# Altium project pdb-24.PrjPcb
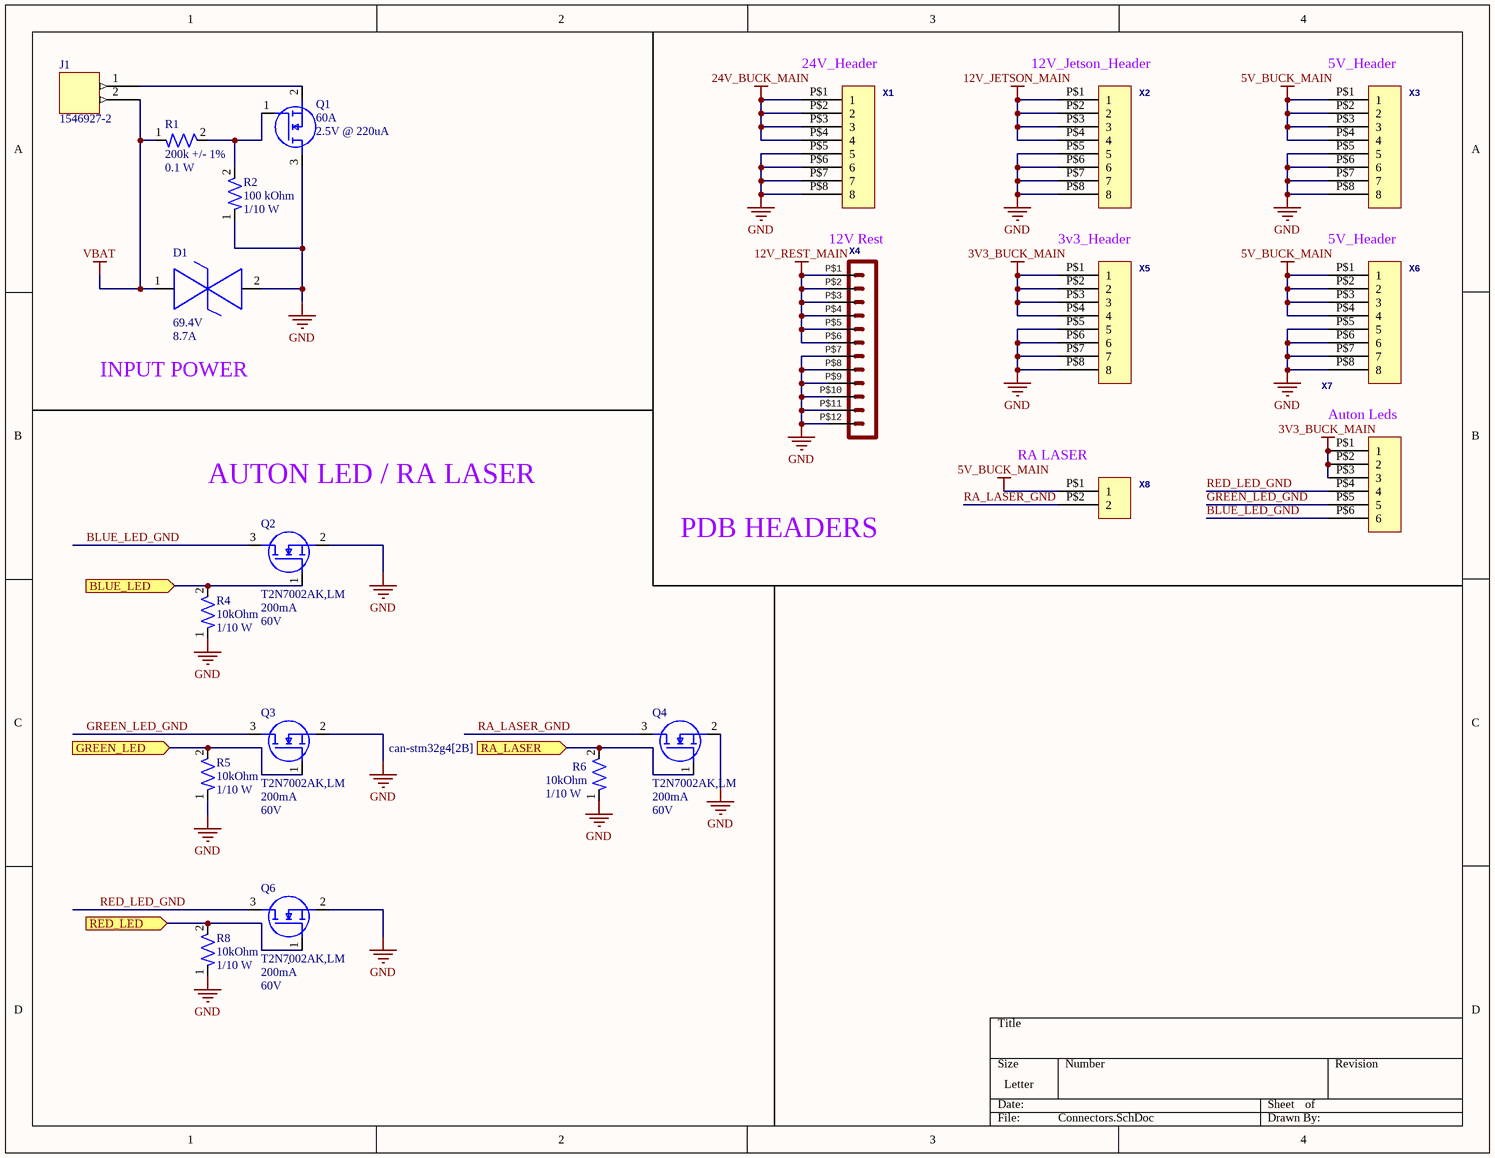
[diagram p0: Connectors.SchDoc]
4 sheets, 122 parts. Net scope: flat (ports and power ports of the same name join across sheets).
Board file: PDB_PCB.PcbDoc
Sheets:
  Connectors.SchDoc
  24V_Main.SchDoc
  12V_For_Bucks.SchDoc
  5V-and-3V3-ldo.SchDoc

## Sheet Connectors.SchDoc
size Letter; SheetNumber: 1; SheetTotal: 9

### Parts
D1  Vclamp: 69.4V  Peak pulser current: 8.7A  [DO-214AA (SMBJ)]  (hidden comment: SMBJE43CAH)
J1  1546927-2  [CONN-1546927-2]
Q1  Drain Current: 60A  Vgs: 2.5V @ 220uA  [NMOS-8PowerVDFN]  (hidden comment: TPH7R006PL,L1Q)
Q2  T2N7002AK,LM  Id-Continuous: 200mA  VDS-Max: 60V  [NMOS-SOT23-3]
Q3  T2N7002AK,LM  Id-Continuous: 200mA  VDS-Max: 60V  [NMOS-SOT23-3]
Q4  T2N7002AK,LM  Id-Continuous: 200mA  VDS-Max: 60V  [NMOS-SOT23-3]
Q6  T2N7002AK,LM  Id-Continuous: 200mA  VDS-Max: 60V  [NMOS-SOT23-3]
R1  Resistance: 200k +/- 1%  Power Rating: 0.1 W  [RES-0603]  (hidden comment: ERJ-3EKF2003V)
R2  Resistance: 100 kOhm  Power: 1/10 W  [RES-0603]  (hidden comment: RC0603FR-07100KL)
R4  Resistance: 10kOhm  Power: 1/10 W  [RES-0603]  (hidden comment: RMCF0603ZT0R00)
R5  Resistance: 10kOhm  Power: 1/10 W  [RES-0603]  (hidden comment: RMCF0603ZT0R00)
R6  Resistance: 10kOhm  Power: 1/10 W  [RES-0603]  (hidden comment: RMCF0603ZT0R00)
R8  Resistance: 10kOhm  Power: 1/10 W  [RES-0603]  (hidden comment: RMCF0603ZT0R00)
X1  Molex 43045-0812  [43045-0812]  (value not drawn)
X2  Molex 43045-0812  [43045-0812]  (value not drawn)
X3  Molex 43045-0812  [43045-0812]  (value not drawn)
X4  Molex - Micro-Fit 3.0 Series connector,  3.00mm (0.118") pitch header, 12 positions.  [43045-1212]  (value not drawn)
X5  Molex 43045-0812  [43045-0812]  (value not drawn)
X6  Molex 43045-0812  [43045-0812]  (value not drawn)
X7  Molex 43045-0612  [43045-0612]  (value not drawn)
X8  Molex 43650-0215  [43650-0215]  (value not drawn)

### Ports
BLUE_LED (in, see can-stm32g4[2C]), GREEN_LED (in, see can-stm32g4[2C]), RA_LASER (in, see can-stm32g4[2B]), RED_LED (in, see can-stm32g4[2C])

### Nets
3V3_BUCK_MAIN: X5.P$1(1) X5.P$2(2) X5.P$3(3) X5.P$4(4) X7.P$1(1) X7.P$2(2) X7.P$3(3)
5V_BUCK_MAIN: X3.P$1(1) X3.P$2(2) X3.P$3(3) X3.P$4(4) X6.P$1(1) X6.P$2(2) X6.P$3(3) X6.P$4(4) X8.P$1(1)
12V_JETSON_MAIN: X2.P$1(1) X2.P$2(2) X2.P$3(3) X2.P$4(4)
12V_REST_MAIN: X4.P$1 X4.P$2 X4.P$3 X4.P$4 X4.P$5 X4.P$6
24V_BUCK_MAIN: X1.P$1(1) X1.P$2(2) X1.P$3(3) X1.P$4(4)
GND: D1.2 Q1.3(D) Q2.2(S) Q3.2(S) Q4.2(S) Q6.2(S) R2.1 R4.1 R5.1 R6.1 R8.1 X1.P$5(5) X1.P$6(6) X1.P$7(7) X1.P$8(8) X2.P$5(5) X2.P$6(6) X2.P$7(7) X2.P$8(8) X3.P$5(5) X3.P$6(6) X3.P$7(7) X3.P$8(8) X4.P$7 X4.P$8 X4.P$9 X4.P$10 X4.P$11 X4.P$12 X5.P$5(5) X5.P$6(6) X5.P$7(7) X5.P$8(8) X6.P$5(5) X6.P$6(6) X6.P$7(7) X6.P$8(8)
VBAT: D1.1 J1.2 R1.1
BLUE_LED_GND: Q2.3(D) X7.P$6(6)
GREEN_LED_GND: Q3.3(D) X7.P$5(5)
RA_LASER_GND: Q4.3(D) X8.P$2(2)
RED_LED_GND: Q6.3(D) X7.P$4(4)
NetJ1_1: J1.1 Q1.2(S)
NetQ1_1: Q1.1(G) R1.2 R2.2
NetQ2_1: Q2.1(G) R4.2 ; port BLUE_LED
NetQ3_1: Q3.1(G) R5.2 ; port GREEN_LED
NetQ4_1: Q4.1(G) R6.2 ; port RA_LASER
NetQ6_1: Q6.1(G) R8.2 ; port RED_LED

### Notes on the sheet
- (near X1) 24V_Header
- (near X2) 12V_Jetson_Header
- (near X3) 5V_Header
- 12V Rest
- 3v3_Header
- 5V_Header
- INPUT POWER
- Auton Leds
- AUTON LED / RA LASER
- (near X8) RA LASER
- PDB HEADERS

### Library data of the parts
D1 = DIO-69.4V-0001: 69.4V Clamp 8.7A Ipp Tvs Diode Surface Mount DO-214AA (SMBJ); Channels: Bidirectional; Breakdown VOltage: 47.8V; Reverse working maximum voltage: 43V; Package: DO-214AA (SMBJ)
J1 = CON-2POS-0003
Q1 = NMOS-60A-0001: N-Channel 60 V 60A (Tc) 81W (Tc) Surface Mount 8-SOP Advance (5x5); Vdss: 60V; Vgs(Max): 20V; Package: 8-PowerVDFN
Q2-Q4 Q6 = NMOS-200MA-0001: MOSFET N-CH 60V 200MA SOT23; Manufacturer: Toshiba; FET type: N-Channel; Rds On-Max: 3.9Ohm; Vgs-Max: 20V; Assembled?: no; Manufacturer Part Number: T2N7002AK,LM; Package: SOT-23-3
R1 = RES-200K-0001: 200 kOhms ±1% 0.1W, 1/10W Chip Resistor 0603 (1608 Metric) Automotive AEC-Q200 Thick Film; Manufacturer: Panasonic Electronic Components; Assembled?: Yes; MFP: ERJ-3EKF2003V; Package SIze: 0603
R2 = RES-100K-0003: 100 kOhms ±1% 0.1W, 1/10W Chip Resistor 0603 (1608 Metric) Moisture Resistant Thick Film; Tolerance: +/- 1%; Assembled?: No; Package Size: 0603
R4-R6 R8 = RES-0-0001: 0 Ohms Jumper 0.1W, 1/10W Chip Resistor 0603 (1608 Metric) Automotive AEC-Q200 Thick Film; Package Size: 0603
X1-X3 X5 X6 = Micro-Fit Molex 8 Pin 2 Row Vertical: GateName_1: G$1; SymbolName_1: HEADER_POS8; DeviceSetName: HEADER_POS8_?; DeviceName: 43045-0812; LibraryName: con-molex-micro-fit-3_0_2; Package: 43045-0812
X4 = HEADER_POS12_?43045-1212: GateName_1: G$1; SymbolName_1: HEADER_POS12; DeviceName: 43045-1212; LibraryName: con-molex-micro-fit-3_0_2; DeviceSetName: HEADER_POS12_?; Package: 43045-1212
X7 = Micro-Fit Molex 6 Pin 2 Row Vertical: GateName_1: G$1; SymbolName_1: HEADER_POS6; DeviceSetName: HEADER_POS6_?; DeviceName: 43045-0612; LibraryName: con-molex-micro-fit-3_0_2; Package: 43045-0612
X8 = Micro-Fit Molex 2 Pin Vertical: GateName_1: G$1; SymbolName_1: HEADER_POS2; DeviceSetName: HEADER_POS2_?; DeviceName: 43650-0215; LibraryName: con-molex-micro-fit-3_0_2; Package: 43650-0215

## Sheet 24V_Main.SchDoc
size A; SheetNumber: 2; SheetTotal: 9
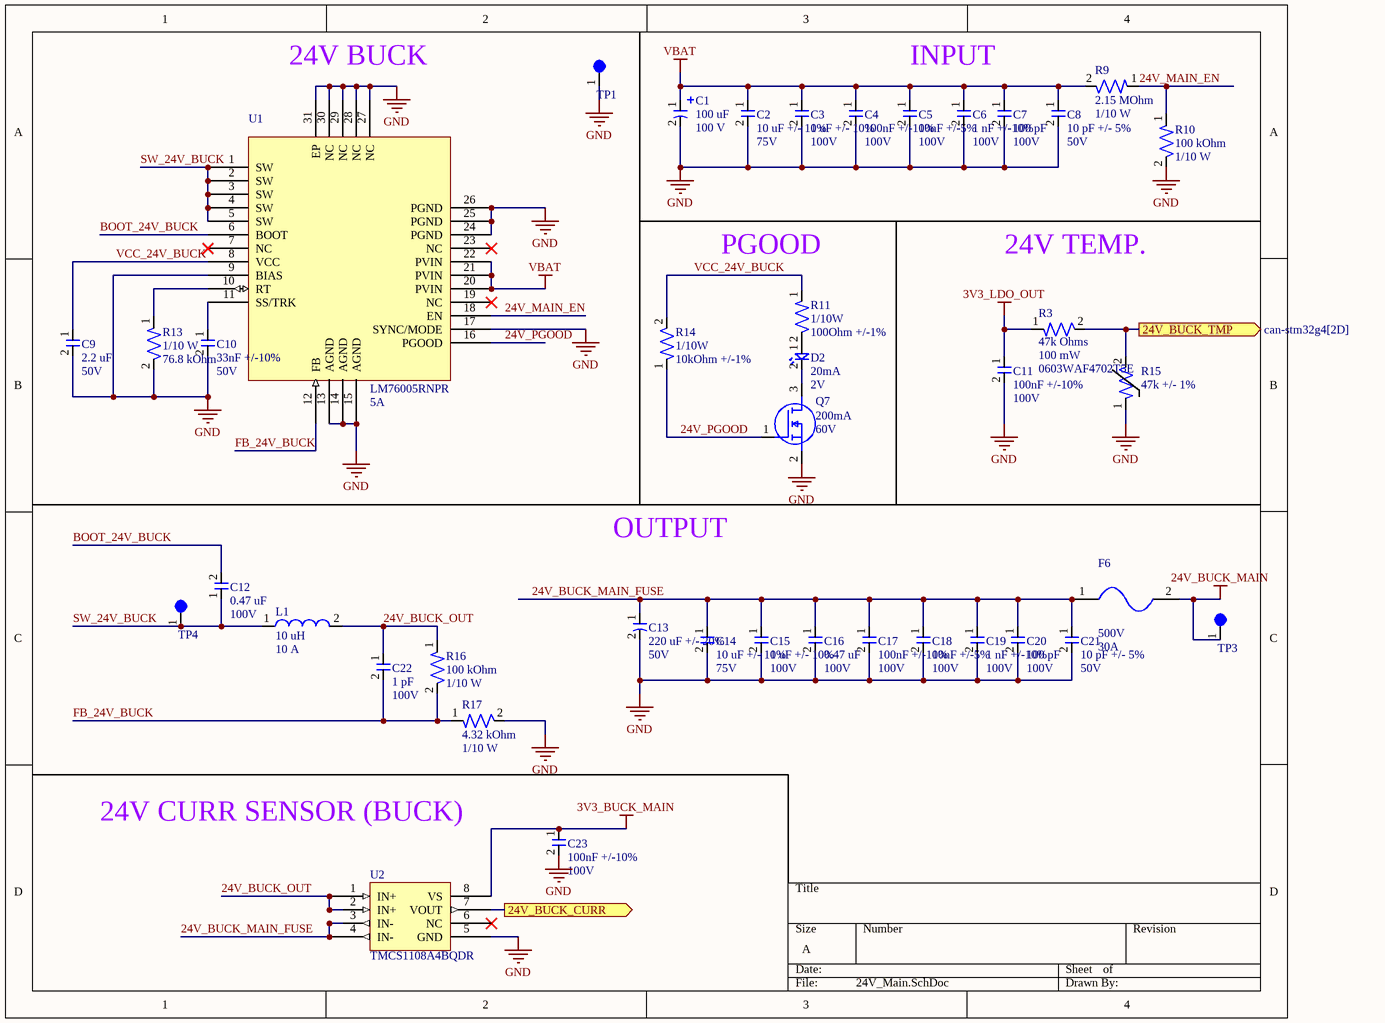
[diagram p1: 24V_Main.SchDoc]

### Parts
C1  Capacitance: 100 uF  Voltage: 100 V  [ELEC-100U-0001]  (hidden comment: 100SEV100M12.5X16)
C2  Capacitance: 10 uF +/- 10%  Voltage Rating: 75V  [CAP-1210]  (hidden comment: C3225X7R1N106K250AC)
C3  Capacitance: 1 uF +/- 10%  Voltage: 100V  [CAP-1206 - duplicate]  (hidden comment: CL31B105KCHNNNE)
C4  Capacitance: 100nF +/-10%  Voltage Rating: 100V  [CAP-0603]  (hidden comment: CC0603KRX7R0BB104)
C5  Capacitance: 10nF +/-5%  Voltage Rating: 100V  [CAP-0603]  (hidden comment: C1608C0G2A103J080AC)
C6  Capacitance: 1 nF +/-10%  Voltage: 100V  [CAP-0603]  (hidden comment: C0603Y102K1RAC7867)
C7  Capacitance: 100 pF  Voltage: 100V  [CAP-0603]  (hidden comment: 0603N101J101CT)
C8  Capacitance: 10 pF +/- 5%  Voltage Rating: 50V  [CAP-0603]  (hidden comment: 0603N100J500CT)
C9  Capacitance: 2.2 uF  oltage: 50V  [CAP-0603]  (hidden comment: UMK107BBJ225KA-T)
C10  Capacitance: 33nF +/-10%  Voltage Rating: 50V  [CAP-0603]  (hidden comment: CC0603KRX7R9BB333)
C11  Capacitance: 100nF +/-10%  Voltage Rating: 100V  [CAP-0603]  (hidden comment: CC0603KRX7R0BB104)
C12  Capacitance: 0.47 uF  Voltage: 100V  [CAP-0805]  (hidden comment: KAM21KR72A474KL)
C13  Capacitance: 220 uF +/- 20%  Voltage Rating: 50V  [ELEC-220U-0003]  (hidden comment: 50TZV220M10X10.5)
C14  Capacitance: 10 uF +/- 10%  Voltage Rating: 75V  [CAP-1210]  (hidden comment: C3225X7R1N106K250AC)
C15  Capacitance: 1 uF +/- 10%  Voltage: 100V  [CAP-1206 - duplicate]  (hidden comment: CL31B105KCHNNNE)
C16  Capacitance: 0.47 uF  Voltage: 100V  [CAP-0805]  (hidden comment: KAM21KR72A474KL)
C17  Capacitance: 100nF +/-10%  Voltage Rating: 100V  [CAP-0603]  (hidden comment: CC0603KRX7R0BB104)
C18  Capacitance: 10nF +/-5%  Voltage Rating: 100V  [CAP-0603]  (hidden comment: C1608C0G2A103J080AC)
C19  Capacitance: 1 nF +/-10%  Voltage: 100V  [CAP-0603]  (hidden comment: C0603Y102K1RAC7867)
C20  Capacitance: 100 pF  Voltage: 100V  [CAP-0603]  (hidden comment: 0603N101J101CT)
C21  Capacitance: 10 pF +/- 5%  Voltage Rating: 50V  [CAP-0603]  (hidden comment: 0603N100J500CT)
C22  Capacitance: 1 pF  Voltage: 100V  [CAP-0603]  (hidden comment: 885012006087)
C23  Capacitance: 100nF +/-10%  Voltage Rating: 100V  [CAP-0603]  (hidden comment: CC0603KRX7R0BB104)
D2  Current Rating: 20mA  Vf: 2V  [LED-0603]  (hidden comment: 150060AS75000)
F6  Voltage Rating: 500V  Current: 30A  [FUSE-ATM-0001]  (hidden comment: 3568)
L1  Inductance: 10 uH  DCI: 10 A  [PWRIND-10U-0002]  (hidden comment: SRP1270-100M)
Q7  Id-Continuous: 200mA  VDS-Max: 60V  [NMOS-SOT23-3]  (hidden comment: T2N7002AK,LM)
R3  0603WAF4702T5E  [RES-0603]
R9  Resistance: 2.15 MOhm  Power: 1/10 W  [RES-0603]  (hidden comment: RC0603FR-072M15L)
R10  Resistance: 100 kOhm  Power: 1/10 W  [RES-0603]  (hidden comment: RC0603FR-07100KL)
R11  Power Rating: 1/10W  Resistance: 100Ohm +/-1%  [RES-0603]  (hidden comment: AC0603FR-10100RL)
R13  Power: 1/10 W  Resistance: 76.8 kOhm  [RES-0603]  (hidden comment: RC0603FR-0776K8L)
R14  Power Rating: 1/10W  Resistance: 10kOhm +/-1%  [RES-0603]  (hidden comment: RC0603FR-0710KP)
R15  Resistance: 47k +/- 1%  [RES-0402]  (hidden comment: TMP6431DECR)
R16  Resistance: 100 kOhm  Power: 1/10 W  [RES-0603]  (hidden comment: RC0603FR-07100KL)
R17  Resistance: 4.32 kOhm  Power: 1/10 W  [RES-0603]  (hidden comment: RC0603FR-074K32L)
TP1  5003  [TEST-POINT-0001]  (value not drawn)
TP3  5003  [TEST-POINT-0001]  (value not drawn)
TP4  5003  [TEST-POINT-0001]  (value not drawn)
U1  LM76005RNPR  Current: 5A  [IC-30-WQFN(6x4)]
U2  TMCS1108A4BQDR  [IC-CURRENT-0001]

### Ports
24V_BUCK_CURR (out, see can-stm32g4[2D]), 24V_BUCK_TMP (out, see can-stm32g4[2D])

### Nets
3V3_BUCK_MAIN: C23.1 U2.8(VS)
3V3_LDO_OUT: C11.1 R3.1
24V_BUCK_MAIN: F6.2 TP3.1
GND: C1.2 C2.2 C3.2 C4.2 C5.2 C6.2 C7.2 C8.2 C9.2 C10.2 C11.2 C13.2 C14.2 C15.2 C16.2 C17.2 C18.2 C19.2 C20.2 C21.2 C23.2 Q7.2(S) R10.2 R13.2 R15.1 R17.2 TP1.1 U1.9(BIAS) U1.13(AGND) U1.14(AGND) U1.15(AGND) U1.17(SYNC/MODE) U1.24(PGND) U1.25(PGND) U1.26(PGND) U1.27(NC) U1.28(NC) U1.29(NC) U1.30(NC) U1.31(EP) U2.5(GND)
VBAT: C1.1 C2.1 C3.1 C4.1 C5.1 C6.1 C7.1 C8.1 R9.2 U1.20(PVIN) U1.21(PVIN) U1.22(PVIN)
24V_BUCK_MAIN_FUSE: C13.1 C14.1 C15.1 C16.1 C17.1 C18.1 C19.1 C20.1 C21.1 F6.1 U2.3(IN-) U2.4(IN-)
24V_BUCK_OUT: C22.1 L1.2 R16.1 U2.1(IN+) U2.2(IN+)
24V_MAIN_EN: R9.1 R10.1 U1.18(EN)
24V_PGOOD: Q7.1(G) R14.1 U1.16(PGOOD)
BOOT_24V_BUCK: C12.2 U1.6(BOOT)
FB_24V_BUCK: C22.2 R16.2 R17.1 U1.12(FB)
SW_24V_BUCK: C12.1 L1.1 TP4.1 U1.1(SW) U1.2(SW) U1.3(SW) U1.4(SW) U1.5(SW)
VCC_24V_BUCK: C9.1 R11.1 R14.2 U1.8(VCC)
NetC10_1: C10.1 U1.11(SS/TRK)
NetD2_1: D2.1 R11.2
NetD2_2: D2.2 Q7.3(D)
NetR3_2: R3.2 R15.2 ; port 24V_BUCK_TMP
NetR13_1: R13.1 U1.10(RT)
NetU2_7: U2.7(VOUT) ; port 24V_BUCK_CURR

Not connected (* = marked no-connect by the designer): U1 7(NC)* 19(NC)* 23(NC)*; U2 6(NC)*

### Notes on the sheet
- 24V BUCK
- INPUT
- (near R11) PGOOD
- 24V TEMP.
- OUTPUT
- 24V CURR SENSOR (BUCK)
- (in symbol RES-47k-0001-JLC) 47k Ohms; 100 mW

### Library data of the parts
C1 = ELEC-100U-0001: 100 µF 100 V Aluminum Electrolytic Capacitors Radial, Can - SMD 2000 Hrs @ 85°C; Manufacturer: Rubycon; Tolerance: +/- 20%; Assembled?: No; ESR: idk check the datasheet i couldnt find it
C2 C14 = CAP-10U-0004: 10 µF ±10% 75V Ceramic Capacitor X7R 1210 (3225 Metric)
C3 C15 = CAP-1U-0001: 1 µF ±10% 100V Ceramic Capacitor X7R 1206 (3216 Metric)
C4 C11 C17 C23 = CAP-100N-0001: CAP CER 0.1UF 100V X7R 0603; Manufacturer: YAGEO; Assembled?: no; Manufacturer Part Number: CC0603KRX7R0BB104; Temperature Coefficient: X7R; Package Size: 0603
C5 C18 = CAP-10N-0002: CAP CER 10000PF 100V C0G 0603; Manufacturer: TDK Corporation; Temperature Coefficient: C0G/NP0; Assembled?: no; Manufacturer Part Number: C1608C0G2A103J080AC; Package Size: 0603
C6 C19 = CAP-1N-0001: 1000 pF ±10% 100V Ceramic Capacitor X7R 0603 (1608 Metric)
C7 C20 = CAP-100P-0002: 100 pF ±5% 100V Ceramic Capacitor C0G, NP0 0603 (1608 Metric); Tolerance: +/-5%; Temp Coeff: C0G/NP0; Package Size: 0603
C8 C21 = CAP-10P-0001: 10 pF ±5% 50V Ceramic Capacitor C0G, NP0 0603 (1608 Metric); Manufacturer: Walshin Technology Corporation; Assembled?: Yes; Manufacturer Part Number: 0603N100J500CT; Temperature Coefficient: C0G, NP0; Package Size: 0603
C9 = CAP-2.2U-0001: 2.2 µF ±10% 50V Ceramic Capacitor X5R 0603 (1608 Metric)
C10 = CAP-33N-0001: 0.033 µF ±10% 50V Ceramic Capacitor X7R 0603 (1608 Metric); Manufacturer: YAGEO; Assembled?: no; Manufacturer Part Number: CC0603KRX7R9BB333; Temperature Coefficient: X7R; Package Size: 0603
C12 C16 = CAP-0.47U-0001: 0.47 µF ±10% 100V Ceramic Capacitor X7R 0805 (2012 Metric); Tolerance: +/- 10%; Assembled?: No; Temperature Coefficient: X7R; Package Size: 0805
C13 = ELEC-220U-0003: 220 µF 50 V Aluminum Electrolytic Capacitors Radial, Can - SMD 2000 Hrs @ 105°C; Size: .406inx.406in*.413in
C22 = CAP-1P-0001: 1 pF ±0.25pF 100V Ceramic Capacitor C0G, NP0 0603 (1608 Metric); Tolerance: +/- 0.25 pF; Temperature Coefficient: C0G/NP0; Assembled?: No; Package Size: 0603
D2 = LED_Amber_0001: CAP CER 0.1UF 100V X7R 0603; Manufacturer: Wurth Electronik; Assembled?: no; Color: Amber; Manufacturer Part Number: 150060AS75000; Package Size: 0603
F6 = FUSE-ATM-0001: Fuse Holder 30 A 500V 1 Circuit Blade Through Hole; Manufacturer Part Number: 3568
L1 = PWRIND-10U-0002: 10 µH Shielded Drum Core, Wirewound Inductor 10 A 16.8mOhm Max Nonstandard; Tolerance: +/- 20%; Isat: 16A; Assembled?: No; DCR: 16.8 mOhm
Q7 = NMOS-200MA-0001: as Q2 on sheet Connectors; Manufacturer Part Number: T2N7002AK,LM; Package: SOT-23-3
R3 = RES-47k-0001-JLC: 100mW Thick Film Resistors 75V ±100ppm/℃ ±1% 47kΩ 0603 Chip Resistor - Surface Mount ROHS; Resistance: 47kOhms; Power: 100mW
R9 = RES-2.15M-0001: 2.15 MOhms ±1% 0.1W, 1/10W Chip Resistor 0603 (1608 Metric) Moisture Resistant Thick Film; Tolerance: +/-1%; Assembled?: No; Package Size: 0603
R10 R16 = RES-100K-0003: as R2 on sheet Connectors; Package Size: 0603
R11 = RES-100-0002: 100 Ohms ±1% 0.1W, 1/10W Chip Resistor 0603 (1608 Metric) Automotive AEC-Q200 Thick Film; Manufacturer: YAGEO; Assembled?: no; Manufacturer Part Number: AC0603FR-10100RL; Package Size: 0603
R13 = RES-76.8K-0001: 76.8 kOhms ±1% 0.1W, 1/10W Chip Resistor 0603 (1608 Metric) Moisture Resistant Thick Film; Manufacturer: Yageo; Tolerance: +/- 1%; Package Size: 0603
R14 = RES-10K-0002: RES SMD 10K OHM 1% 1/10W 0603; Manufacturer: YAGEO; Assembled?: no; Manufacturer Part Number: RC0603FR-0710KP; Package Size: 0603
R15 = THERM-47K-0001: PTC Thermistor 47 kOhms 0402 (1006 Metric); Manufacturer: Texas Instruments; Manufacturer Part Number: TMP6431DECR; Package Size: 0402
R17 = RES-4.32K-0001: 4.32 kOhms ±1% 0.1W, 1/10W Chip Resistor 0603 (1608 Metric) Moisture Resistant Thick Film; Tolerance: +/-1%; Assembled?: No; Package Size: 0603
TP1 TP3 TP4 = TEST-POINT-0001: Oranange PC Test Point, Miniature Phoisphor Bronze Silver Plating Through Hole Mounting Type
U1 = IC-BUCK-0006: Buck Switching Regulator IC Positive Adjustable 1V 1 Output 5A 30-WFQFN Exposed Pad; Manufacturer: Texas Instruments; Assembled?: no; Manufacturer Part Number: LM76005RNPR; Type: Buck; Package: 30-WFQFN
U2 = IC-CURRENT-0004: Current Sensor 1 Channel Hall Effect Bidirectional 8-SOIC (0.154", 3.90mm Width); Assembled?: No; Supply Voltage: 5V; Footprint: 8-SOIC

## Sheet 12V_For_Bucks.SchDoc
size A; SheetNumber: 4; SheetTotal: 9
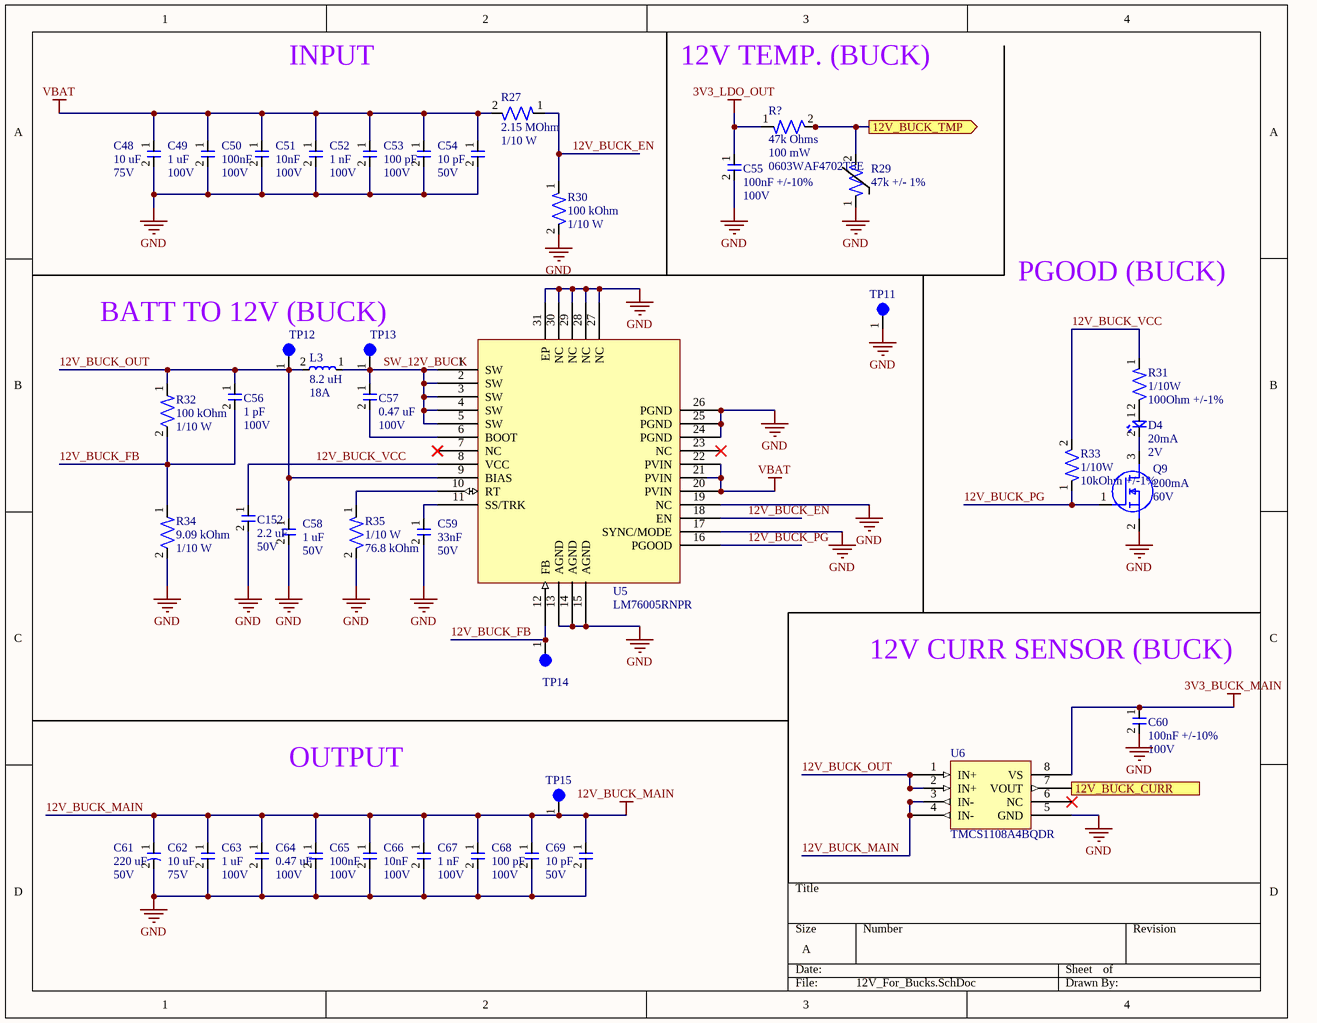
[diagram p2: 12V_For_Bucks.SchDoc]

### Parts
C48  Capacitance: 10 uF  Voltage Rating: 75V  [CAP-1210]  (hidden comment: C3225X7R1N106K250AC)
C49  Capacitance: 1 uF  Voltage: 100V  [CAP-1206 - duplicate]  (hidden comment: CL31B105KCHNNNE)
C50  Capacitance: 100nF  Voltage Rating: 100V  [CAP-0603]  (hidden comment: CC0603KRX7R0BB104)
C51  Capacitance: 10nF  Voltage Rating: 100V  [CAP-0603]  (hidden comment: C1608C0G2A103J080AC)
C52  Capacitance: 1 nF  Voltage: 100V  [CAP-0603]  (hidden comment: C0603Y102K1RAC7867)
C53  Capacitance: 100 pF  Voltage: 100V  [CAP-0603]  (hidden comment: 0603N101J101CT)
C54  Capacitance: 10 pF  Voltage Rating: 50V  [CAP-0603]  (hidden comment: 0603N100J500CT)
C55  Capacitance: 100nF +/-10%  Voltage Rating: 100V  [CAP-0603]  (hidden comment: CC0603KRX7R0BB104)
C56  Capacitance: 1 pF  Voltage: 100V  [CAP-0603]  (hidden comment: 885012006087)
C57  Capacitance: 0.47 uF  Voltage: 100V  [CAP-0805]  (hidden comment: KAM21KR72A474KL)
C58  Capacitance: 1 uF  Voltage: 50V  [CAP-0603]  (hidden comment: UMK107AB7105KA-T)
C59  Capacitance: 33nF  Voltage Rating: 50V  [CAP-0603]  (hidden comment: CC0603KRX7R9BB333)
C60  Capacitance: 100nF +/-10%  Voltage Rating: 100V  [CAP-0603]  (hidden comment: CC0603KRX7R0BB104)
C61  Capacitance: 220 uF  Voltage Rating: 50V  [ELEC-220U-0003]  (hidden comment: 50TZV220M10X10.5)
C62  Capacitance: 10 uF  Voltage Rating: 75V  [CAP-1210]  (hidden comment: C3225X7R1N106K250AC)
C63  Capacitance: 1 uF  Voltage: 100V  [CAP-1206 - duplicate]  (hidden comment: CL31B105KCHNNNE)
C64  Capacitance: 0.47 uF  Voltage: 100V  [CAP-0805]  (hidden comment: KAM21KR72A474KL)
C65  Capacitance: 100nF  Voltage Rating: 100V  [CAP-0603]  (hidden comment: CC0603KRX7R0BB104)
C66  Capacitance: 10nF  Voltage Rating: 100V  [CAP-0603]  (hidden comment: C1608C0G2A103J080AC)
C67  Capacitance: 1 nF  Voltage: 100V  [CAP-0603]  (hidden comment: C0603Y102K1RAC7867)
C68  Capacitance: 100 pF  Voltage: 100V  [CAP-0603]  (hidden comment: 0603N101J101CT)
C69  Capacitance: 10 pF  Voltage Rating: 50V  [CAP-0603]  (hidden comment: 0603N100J500CT)
C152  Capacitance: 2.2 uF  oltage: 50V  [CAP-0603]  (hidden comment: UMK107BBJ225KA-T)
D4  Current Rating: 20mA  Vf: 2V  [LED-0603]  (hidden comment: 150060AS75000)
L3  Inductance: 8.2 uH  DCI: 18A  [PWRIND-8.2U-0002]  (hidden comment: IHLP6767GZER8R2M01)
Q9  Id-Continuous: 200mA  VDS-Max: 60V  [NMOS-SOT23-3]  (hidden comment: T2N7002AK,LM)
R27  Resistance: 2.15 MOhm  Power: 1/10 W  [RES-0603]  (hidden comment: RC0603FR-072M15L)
R29  Resistance: 47k +/- 1%  [RES-0402]  (hidden comment: TMP6431DECR)
R30  Resistance: 100 kOhm  Power: 1/10 W  [RES-0603]  (hidden comment: RC0603FR-07100KL)
R31  Power Rating: 1/10W  Resistance: 100Ohm +/-1%  [RES-0603]  (hidden comment: AC0603FR-10100RL)
R32  Resistance: 100 kOhm  Power: 1/10 W  [RES-0603]  (hidden comment: RC0603FR-07100KL)
R33  Power Rating: 1/10W  Resistance: 10kOhm +/-1%  [RES-0603]  (hidden comment: RC0603FR-0710KP)
R34  Resistance: 9.09 kOhm  Power: 1/10 W  [RES-0603]  (hidden comment: RC0603FR-079K09L)
R35  Power: 1/10 W  Resistance: 76.8 kOhm  [RES-0603]  (hidden comment: RC0603FR-0776K8L)
R?  0603WAF4702T5E  [RES-0603]
TP11  5003  [TEST-POINT-0001]  (value not drawn)
TP12  5003  [TEST-POINT-0001]  (value not drawn)
TP13  5003  [TEST-POINT-0001]  (value not drawn)
TP14  5003  [TEST-POINT-0001]  (value not drawn)
TP15  5003  [TEST-POINT-0001]  (value not drawn)
U5  LM76005RNPR  [IC-30-WQFN(6x4)]
U6  TMCS1108A4BQDR  [IC-CURRENT-0001]

### Ports
12V_BUCK_CURR (out, see can-stm32g4[1D]), 12V_BUCK_TMP (out, see can-stm32g4[1D])

### Nets
3V3_BUCK_MAIN: C60.1 U6.8(VS)
3V3_LDO_OUT: C55.1 R?.1
12V_BUCK_MAIN: C61.1 C62.1 C63.1 C64.1 C65.1 C66.1 C67.1 C68.1 C69.1 TP15.1 U6.3(IN-) U6.4(IN-)
GND: C48.2 C49.2 C50.2 C51.2 C52.2 C53.2 C54.2 C55.2 C58.2 C59.2 C60.2 C61.2 C62.2 C63.2 C64.2 C65.2 C66.2 C67.2 C68.2 C69.2 C152.2 Q9.2(S) R29.1 R30.2 R34.2 R35.2 TP11.1 U5.13(AGND) U5.14(AGND) U5.15(AGND) U5.17(SYNC/MODE) U5.19(NC) U5.24(PGND) U5.25(PGND) U5.26(PGND) U5.27(NC) U5.28(NC) U5.29(NC) U5.30(NC) U5.31(EP) U6.5(GND)
VBAT: C48.1 C49.1 C50.1 C51.1 C52.1 C53.1 C54.1 R27.2 U5.20(PVIN) U5.21(PVIN) U5.22(PVIN)
12V_BUCK_EN: R27.1 R30.1 U5.18(EN)
12V_BUCK_FB: C56.2 R32.2 R34.1 TP14.1 U5.12(FB)
12V_BUCK_OUT: C56.1 C58.1 L3.2 R32.1 TP12.1 U5.9(BIAS) U6.1(IN+) U6.2(IN+)
12V_BUCK_PG: Q9.1(G) R33.1 U5.16(PGOOD)
12V_BUCK_VCC: C152.1 R31.1 R33.2 U5.8(VCC)
SW_12V_BUCK: C57.1 L3.1 TP13.1 U5.1(SW) U5.2(SW) U5.3(SW) U5.4(SW) U5.5(SW)
NetC57_2: C57.2 U5.6(BOOT)
NetC59_1: C59.1 U5.11(SS/TRK)
NetD4_1: D4.1 R31.2
NetD4_2: D4.2 Q9.3(D)
NetR29_2: R29.2 R?.2 ; port 12V_BUCK_TMP
NetR35_1: R35.1 U5.10(RT)
NetU6_7: U6.7(VOUT) ; port 12V_BUCK_CURR

Not connected (* = marked no-connect by the designer): U5 7(NC)* 23(NC)*; U6 6(NC)*

### Notes on the sheet
- INPUT
- 12V TEMP. (BUCK)
- PGOOD (BUCK)
- BATT TO 12V (BUCK)
- (near C60) 12V CURR SENSOR (BUCK)
- OUTPUT
- (in symbol RES-47k-0001-JLC) 47k Ohms; 100 mW

### Library data of the parts
C48 C62 = CAP-10U-0004: as C2 on sheet 24V_Main
C49 C63 = CAP-1U-0001: as C3 on sheet 24V_Main
C50 C55 C60 C65 = CAP-100N-0001: as C4 on sheet 24V_Main; Manufacturer Part Number: CC0603KRX7R0BB104; Temperature Coefficient: X7R; Package Size: 0603
C51 C66 = CAP-10N-0002: as C5 on sheet 24V_Main; Manufacturer Part Number: C1608C0G2A103J080AC; Package Size: 0603
C52 C67 = CAP-1N-0001: as C6 on sheet 24V_Main
C53 C68 = CAP-100P-0002: as C7 on sheet 24V_Main; Package Size: 0603
C54 C69 = CAP-10P-0001: as C8 on sheet 24V_Main; Manufacturer Part Number: 0603N100J500CT; Temperature Coefficient: C0G, NP0; Package Size: 0603
C56 = CAP-1P-0001: as C22 on sheet 24V_Main; Package Size: 0603
C57 C64 = CAP-0.47U-0001: as C12 on sheet 24V_Main; Temperature Coefficient: X7R; Package Size: 0805
C58 = CAP-1U-0002: 1 µF ±10% 50V Ceramic Capacitor X7R 0603 (1608 Metric); Package Size: 0603
C59 = CAP-33N-0001: as C10 on sheet 24V_Main; Manufacturer Part Number: CC0603KRX7R9BB333; Temperature Coefficient: X7R; Package Size: 0603
C61 = ELEC-220U-0003: as C13 on sheet 24V_Main; Size: .406inx.406in*.413in
C152 = CAP-2.2U-0001: as C9 on sheet 24V_Main
D4 = LED_Amber_0001: as D2 on sheet 24V_Main; Manufacturer Part Number: 150060AS75000; Package Size: 0603
L3 = PWRIND-8.2U-0002: 8.2 µH Shielded Molded Inductor 18 A 10.66mOhm Max Nonstandard; Isat: 25A; Tolerance: +/-20%; DCR: 10.66 mOhm
Q9 = NMOS-200MA-0001: as Q2 on sheet Connectors; Manufacturer Part Number: T2N7002AK,LM; Package: SOT-23-3
R27 = RES-2.15M-0001: as R9 on sheet 24V_Main; Package Size: 0603
R29 = THERM-47K-0001: as R15 on sheet 24V_Main; Manufacturer Part Number: TMP6431DECR; Package Size: 0402
R30 R32 = RES-100K-0003: as R2 on sheet Connectors; Package Size: 0603
R31 = RES-100-0002: as R11 on sheet 24V_Main; Manufacturer Part Number: AC0603FR-10100RL; Package Size: 0603
R33 = RES-10K-0002: as R14 on sheet 24V_Main; Manufacturer Part Number: RC0603FR-0710KP; Package Size: 0603
R34 = RES-9.09K-0001: 9.09 kOhms ±1% 0.1W, 1/10W Chip Resistor 0603 (1608 Metric) Moisture Resistant Thick Film; Tolerance: +/-1%; Assembled?: No; Package Size: 0603
R35 = RES-76.8K-0001: as R13 on sheet 24V_Main; Package Size: 0603
R? = RES-47k-0001-JLC: as R3 on sheet 24V_Main; Power: 100mW
TP11-TP15 = TEST-POINT-0001: as TP1 on sheet 24V_Main
U5 = IC-BUCK-0006: as U1 on sheet 24V_Main; Manufacturer Part Number: LM76005RNPR; Type: Buck; Package: 30-WFQFN; Current: LM76005RNPR
U6 = IC-CURRENT-0004: as U2 on sheet 24V_Main; Footprint: 8-SOIC

## Sheet 5V-and-3V3-ldo.SchDoc
size A; SheetNumber: 8; SheetTotal: 9
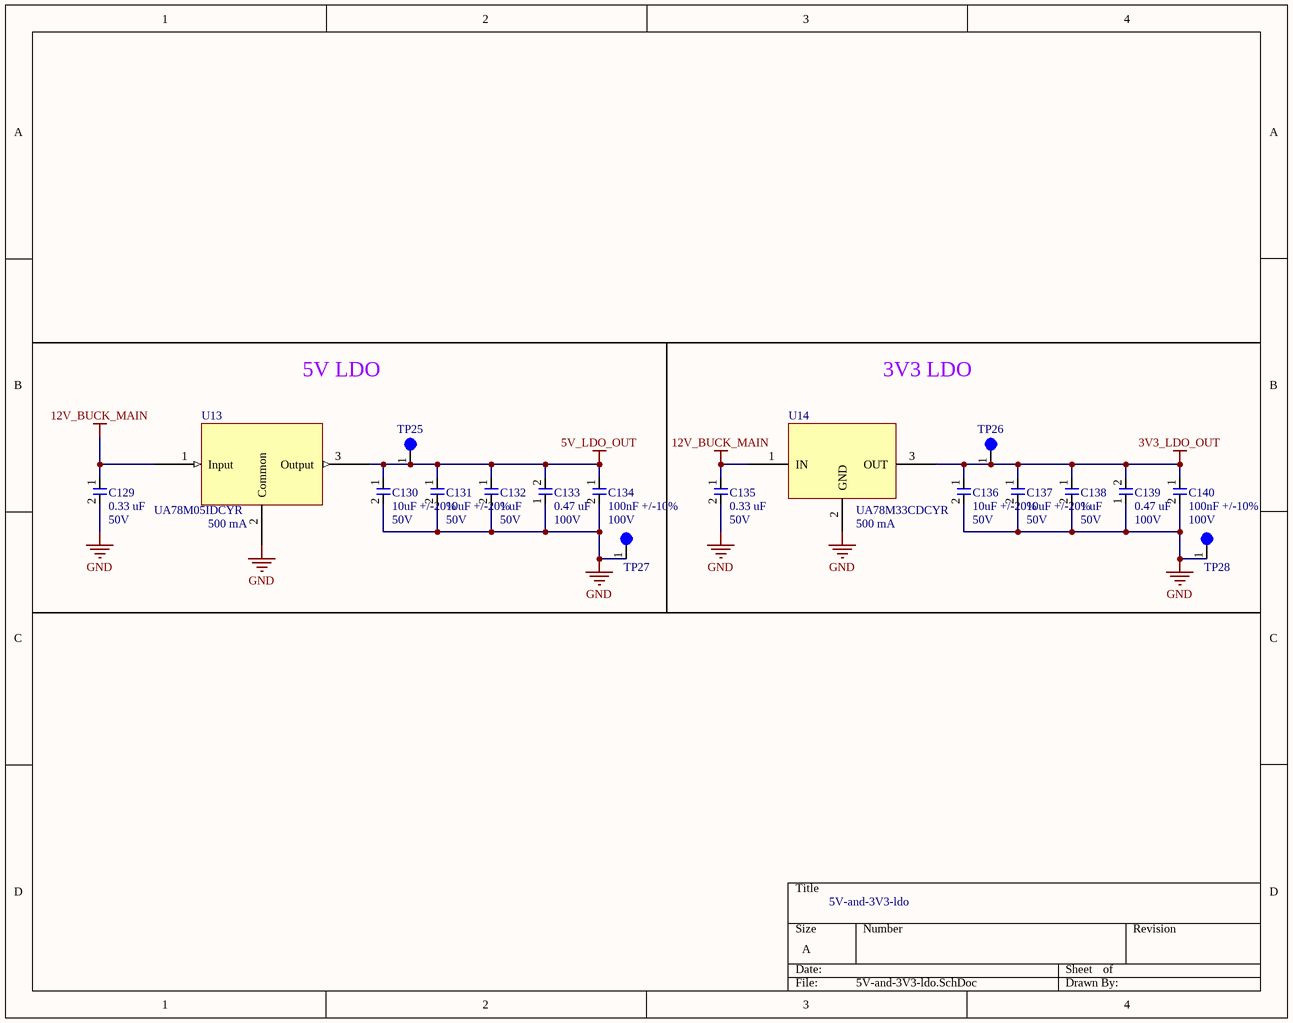
[diagram p3: 5V-and-3V3-ldo.SchDoc]

### Parts
C129  Capacitance: 0.33 uF  Voltage: 50V  [CAP-0603]  (hidden comment: CGA3E3X7R1H334K080AB)
C130  Capacitance: 10uF +/-20%  Voltage Rating: 50V  [CAP-1206]  (hidden comment: CL31B106KBHNNNE)
C131  Capacitance: 10uF +/-20%  Voltage Rating: 50V  [CAP-1206]  (hidden comment: CL31B106KBHNNNE)
C132  Capacitance: 1 uF  Voltage: 50V  [CAP-0603]  (hidden comment: UMK107AB7105KA-T)
C133  Capacitance: 0.47 uF  Voltage: 100V  [CAP-0805]  (hidden comment: KAM21KR72A474KL)
C134  Capacitance: 100nF +/-10%  Voltage Rating: 100V  [CAP-0603]  (hidden comment: CC0603KRX7R0BB104)
C135  Capacitance: 0.33 uF  Voltage: 50V  [CAP-0603]  (hidden comment: CGA3E3X7R1H334K080AB)
C136  Capacitance: 10uF +/-20%  Voltage Rating: 50V  [CAP-1206]  (hidden comment: CL31B106KBHNNNE)
C137  Capacitance: 10uF +/-20%  Voltage Rating: 50V  [CAP-1206]  (hidden comment: CL31B106KBHNNNE)
C138  Capacitance: 1 uF  Voltage: 50V  [CAP-0603]  (hidden comment: UMK107AB7105KA-T)
C139  Capacitance: 0.47 uF  Voltage: 100V  [CAP-0805]  (hidden comment: KAM21KR72A474KL)
C140  Capacitance: 100nF +/-10%  Voltage Rating: 100V  [CAP-0603]  (hidden comment: CC0603KRX7R0BB104)
TP25  5003  [TEST-POINT-0001]  (value not drawn)
TP26  5003  [TEST-POINT-0001]  (value not drawn)
TP27  5003  [TEST-POINT-0001]  (value not drawn)
TP28  5003  [TEST-POINT-0001]  (value not drawn)
U13  UA78M05IDCYR  Current: 500 mA  [IC-SOT-223-4]
U14  UA78M33CDCYR  Current: 500 mA  [IC-SOT-223-4]

### Nets
3V3_LDO_OUT: C136.1 C137.1 C138.1 C139.2 C140.1 TP26.1 U14.3(OUT)
5V_LDO_OUT: C130.1 C131.1 C132.1 C133.2 C134.1 TP25.1 U13.3(Output)
12V_BUCK_MAIN: C129.1 C135.1 U13.1(Input) U14.1(IN)
GND: C129.2 C130.2 C131.2 C132.2 C133.1 C134.2 C135.2 C136.2 C137.2 C138.2 C139.1 C140.2 TP27.1 TP28.1 U13.2(Common) U14.2(GND)

### Notes on the sheet
- 5V LDO
- 3V3 LDO
- 5V-and-3V3-ldo

### Library data of the parts
C129 C135 = CAP-0.33uF-0001: 0.33 µF ±10% 50V Ceramic Capacitor X7R 0603 (1608 Metric); Manufacturer: TDK Corporation; Tolerance: +/- 10%; Manufacturer Part Number: CGA3E3X7R1H334K080AB; Temperature Coefficient: X7R
C130 C131 C136 C137 = CAP-10U-0001: 10 µF ±10% 50V Ceramic Capacitor X7R 1206 (3216 Metric); Manufacturer: Samsung Electro-Mechanics; Assembled?: no; Manufacturer Part Number: CL31B106KBHNNNE; Temperature Coefficient: X7R; Package Size: 1206
C132 C138 = CAP-1U-0002: as C58 on sheet 12V_For_Bucks; Package Size: 0603
C133 C139 = CAP-0.47U-0001: as C12 on sheet 24V_Main; Temperature Coefficient: X7R; Package Size: 0805
C134 C140 = CAP-100N-0001: as C4 on sheet 24V_Main; Manufacturer Part Number: CC0603KRX7R0BB104; Temperature Coefficient: X7R; Package Size: 0603
TP25-TP28 = TEST-POINT-0001: as TP1 on sheet 24V_Main
U13 = IC-LDO-5V-0003: Linear Voltage Regulator IC Positive Fixed 1 Output 500mA SOT-223-4; Manufacturer: Texas Instruments; Assembled?: no; Manufacturer Part Number: UA78M05IDCYR; Package Size: SOT223-4; Type: Low dropout (LDO)
U14 = IC-LDO-3.3V-0002: Linear Voltage Regulator IC Positive Fixed 1 Output 500mA SOT-223-4; Vin: 25V; Vout: 3.3V; Package: SOT-223-4

## Nets that join several sheets
3V3_BUCK_MAIN: Connectors (7 pins), 24V_Main (C23.1 U2.8), 12V_For_Bucks (C60.1 U6.8)
3V3_LDO_OUT: 24V_Main (C11.1 R3.1), 12V_For_Bucks (C55.1 R?.1), 5V-and-3V3-ldo (7 pins)
12V_BUCK_MAIN: 12V_For_Bucks (12 pins), 5V-and-3V3-ldo (C129.1 C135.1 U13.1 U14.1)
24V_BUCK_MAIN: Connectors (X1.P$1 X1.P$2 X1.P$3 X1.P$4), 24V_Main (F6.2 TP3.1)
GND: Connectors (37 pins), 24V_Main (41 pins), 12V_For_Bucks (41 pins), 5V-and-3V3-ldo (16 pins)
VBAT: Connectors (D1.1 J1.2 R1.1), 24V_Main (12 pins), 12V_For_Bucks (11 pins)